# Altium schematic sheet DRV8313_Main.SchDoc
size A4
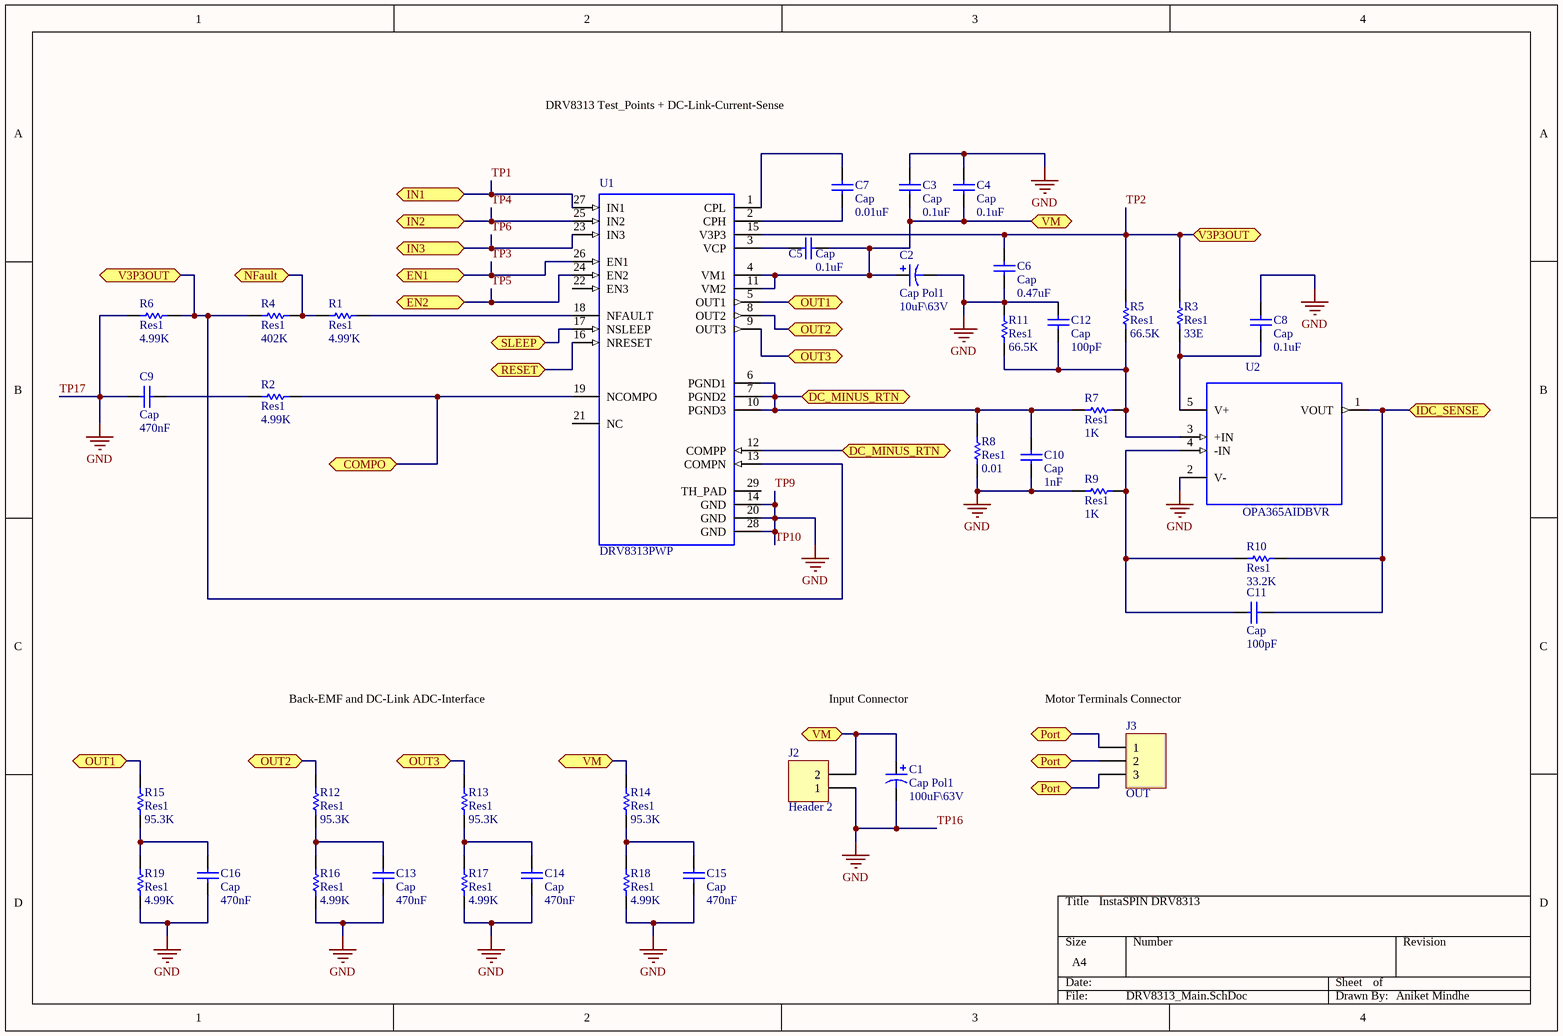
[diagram p0: DRV8313_Main.SchDoc]

## Parts
C1  Cap Pol1  value 100uF\63V  [RB7.6-15]
C2  Cap Pol1  value 10uF\63V  [RB7.6-15]
C3  Cap  value 0.1uF  [RAD-0.3]
C4  Cap  value 0.1uF  [RAD-0.3]
C5  Cap  value 0.1uF  [RAD-0.3]
C6  Cap  value 0.47uF  [RAD-0.3]
C7  Cap  value 0.01uF  [RAD-0.3]
C8  Cap  value 0.1uF  [RAD-0.3]
C9  Cap  value 470nF  [RAD-0.3]
C10  Cap  value 1nF  [RAD-0.3]
C11  Cap  value 100pF  [RAD-0.3]
C12  Cap  value 100pF  [RAD-0.3]
C13  Cap  value 470nF  [RAD-0.3]
C14  Cap  value 470nF  [RAD-0.3]
C15  Cap  value 470nF  [RAD-0.3]
C16  Cap  value 470nF  [RAD-0.3]
J2  Header 2  [HDR1X2]
J3  OUT  [HDR1X3]
R1  Res1  value 4.99'K  [AXIAL-0.3]
R2  Res1  value 4.99K  [AXIAL-0.3]
R3  Res1  value 33E  [AXIAL-0.3]
R4  Res1  value 402K  [AXIAL-0.3]
R5  Res1  value 66.5K  [AXIAL-0.3]
R6  Res1  value 4.99K  [AXIAL-0.3]
R7  Res1  value 1K  [AXIAL-0.3]
R8  Res1  value 0.01  [AXIAL-0.3]
R9  Res1  value 1K  [AXIAL-0.3]
R10  Res1  value 33.2K  [AXIAL-0.3]
R11  Res1  value 66.5K  [AXIAL-0.3]
R12  Res1  value 95.3K  [AXIAL-0.3]
R13  Res1  value 95.3K  [AXIAL-0.3]
R14  Res1  value 95.3K  [AXIAL-0.3]
R15  Res1  value 95.3K  [AXIAL-0.3]
R16  Res1  value 4.99K  [AXIAL-0.3]
R17  Res1  value 4.99K  [AXIAL-0.3]
R18  Res1  value 4.99K  [AXIAL-0.3]
R19  Res1  value 4.99K  [AXIAL-0.3]
U1  DRV8313PWP  [SOP28P65_970X640X120L60X24T483X275N]
U2  OPA365AIDBVR  [SOT95P280X145-5N]

## Ports
COMPO, DC_MINUS_RTN, EN1, EN2, IDC_SENSE, IN1, IN2, IN3, NFault, OUT1, OUT2, OUT3, Port, RESET, SLEEP, V3P3OUT, VM

## Nets
TP10: C1.2 C2.2 C3.2 C4.2 C6.1 C8.2 C9.1 C10.1 C12.2 C13.1 C14.1 C15.1 C16.1 J2.1 R6.2 R8.1 R9.1 R11.2 R16.1 R17.1 R18.1 R19.1 U1.14(GND) U1.20(GND) U1.28(GND) U2.2(V-)  [also labelled GND, TP16, TP17, TP9]
COMPO: R2.2 U1.19(NCOMPO) ; port COMPO
DC_MINUS_RTN: C10.2 R7.1 R8.2 U1.6(PGND1) U1.7(PGND2) U1.10(PGND3) U1.12(COMPP) ; port DC_MINUS_RTN
IDC_SENSE: C11.2 R10.1 U2.1(VOUT) ; port IDC_SENSE
NFault: R1.1 R4.2 ; port NFault
OUT1: R15.2 U1.5(OUT1) ; port OUT1
OUT2: R12.2 U1.8(OUT2) ; port OUT2
OUT3: R13.2 U1.9(OUT3) ; port OUT3
Port: J3.1 J3.2 J3.3 ; port Port
RESET: U1.16(NRESET) ; port RESET
SLEEP: U1.17(NSLEEP) ; port SLEEP
TP1: U1.27(IN1) ; port IN1
TP2: C6.2 R3.2 R4.1 R5.2 R6.1 U1.13(COMPN) U1.15(V3P3) ; port V3P3OUT
TP3: U1.26(EN1) ; port EN1
TP4: U1.25(IN2) ; port IN2
TP5: U1.24(EN2) ; port EN2
TP6: U1.23(IN3) ; port IN3
VM: C1.1 C2.1 C3.1 C4.1 C5.1 J2.2 R14.2 U1.4(VM1) U1.11(VM2) ; port VM
NetC5_2: C5.2 U1.3(VCP)
NetC7_1: C7.1 U1.2(CPH)
NetC7_2: C7.2 U1.1(CPL)
NetC8_1: C8.1 R3.1 U2.5(V+)
NetC9_2: C9.2 R2.1
NetC11_1: C11.1 R9.2 R10.2 U2.4(-IN)
NetC12_1: C12.1 R5.1 R7.2 R11.1 U2.3(+IN)
NetC13_2: C13.2 R12.1 R16.2
NetC14_2: C14.2 R13.1 R17.2
NetC15_2: C15.2 R14.1 R18.2
NetC16_2: C16.2 R15.1 R19.2
NetR1_2: R1.2 U1.18(NFAULT)

Not connected (* = marked no-connect by the designer): U1 21(NC) 22(EN3) 29(TH_PAD)

## Notes on the sheet
- DRV8313 Test_Points + DC-Link-Current-Sense
- Back-EMF and DC-Link ADC-Interface
- Input Connector
- (near J3) Motor Terminals Connector
- InstaSPIN DRV8313
- Aniket Mindhe

## Library data of the parts
C1 C2 = Cap Pol1: Polarized Capacitor (Radial); Published: 8-Jun-2000; LatestRevisionDate: 17-Jul-2002; LatestRevisionNote: Re-released for DXP Platform.; PackageReference: RB7.6-15; Publisher: Altium Limited; PackageDescription: Polarized Capacitor (Radial); 2 Leads
C3-C16 = Cap: Capacitor; Published: 8-Jun-2000; LatestRevisionDate: 17-Jul-2002; LatestRevisionNote: Re-released for DXP Platform.; PackageReference: RAD-0.3; Publisher: Altium Limited; PackageDescription: Radial Cap, Thru-Hole; 2 Leads; 0.3 in Pin Spacing
J2 = Header 2: Header, 2-Pin; LatestRevisionDate: 17-Jul-2002; LatestRevisionNote: Re-released for DXP Platform.; Publisher: Altium Limited
J3 = Header 3: Header, 3-Pin; LatestRevisionDate: 17-Jul-2002; LatestRevisionNote: Re-released for DXP Platform.; Publisher: Altium Limited
R1-R19 = Res1: Resistor; Published: 8-Jun-2000; LatestRevisionDate: 17-Jul-2002; LatestRevisionNote: Re-released for DXP Platform.; PackageReference: AXIAL-0.3; Publisher: Altium Limited; PackageDescription: Axial Device, Thru-Hole; 2 Leads; 0.3 in Pin Spacing
U1 = DRV8313PWP: 2.5A Three Phase Brushless DC Motor Driver _PWM Ctrl_ 28-HTSSOP -40 to 85; MF: Texas Instruments; SnapEDA_Link: https://www.snapeda.com/parts/DRV8313PWP/Texas%20Instruments/view-part/?ref=snap; Price: None; MP: DRV8313PWP; Package: HTSSOP-28 Texas Instruments; Availability: Unavailable; Value: *
U2 = OPA365AIDBVR: 2.2V, 50MHz, Low-Noise, Single-Supply Rail-to-Rail Operational Amplifier 5-SOT-23 -40 to 125; MF: Texas Instruments; MP: OPA365AIDBVR; Package: SOT-23-5 Texas Instruments; Availability: Unavailable; Price: None; SnapEDA_Link: https://www.snapeda.com/parts/OPA365AIDBVR/Texas%20Instruments/view-part/?ref=snap; Value: *